# Altium schematic sheet Breeze2 Main V1.SchDoc
size 457 x 508 mm
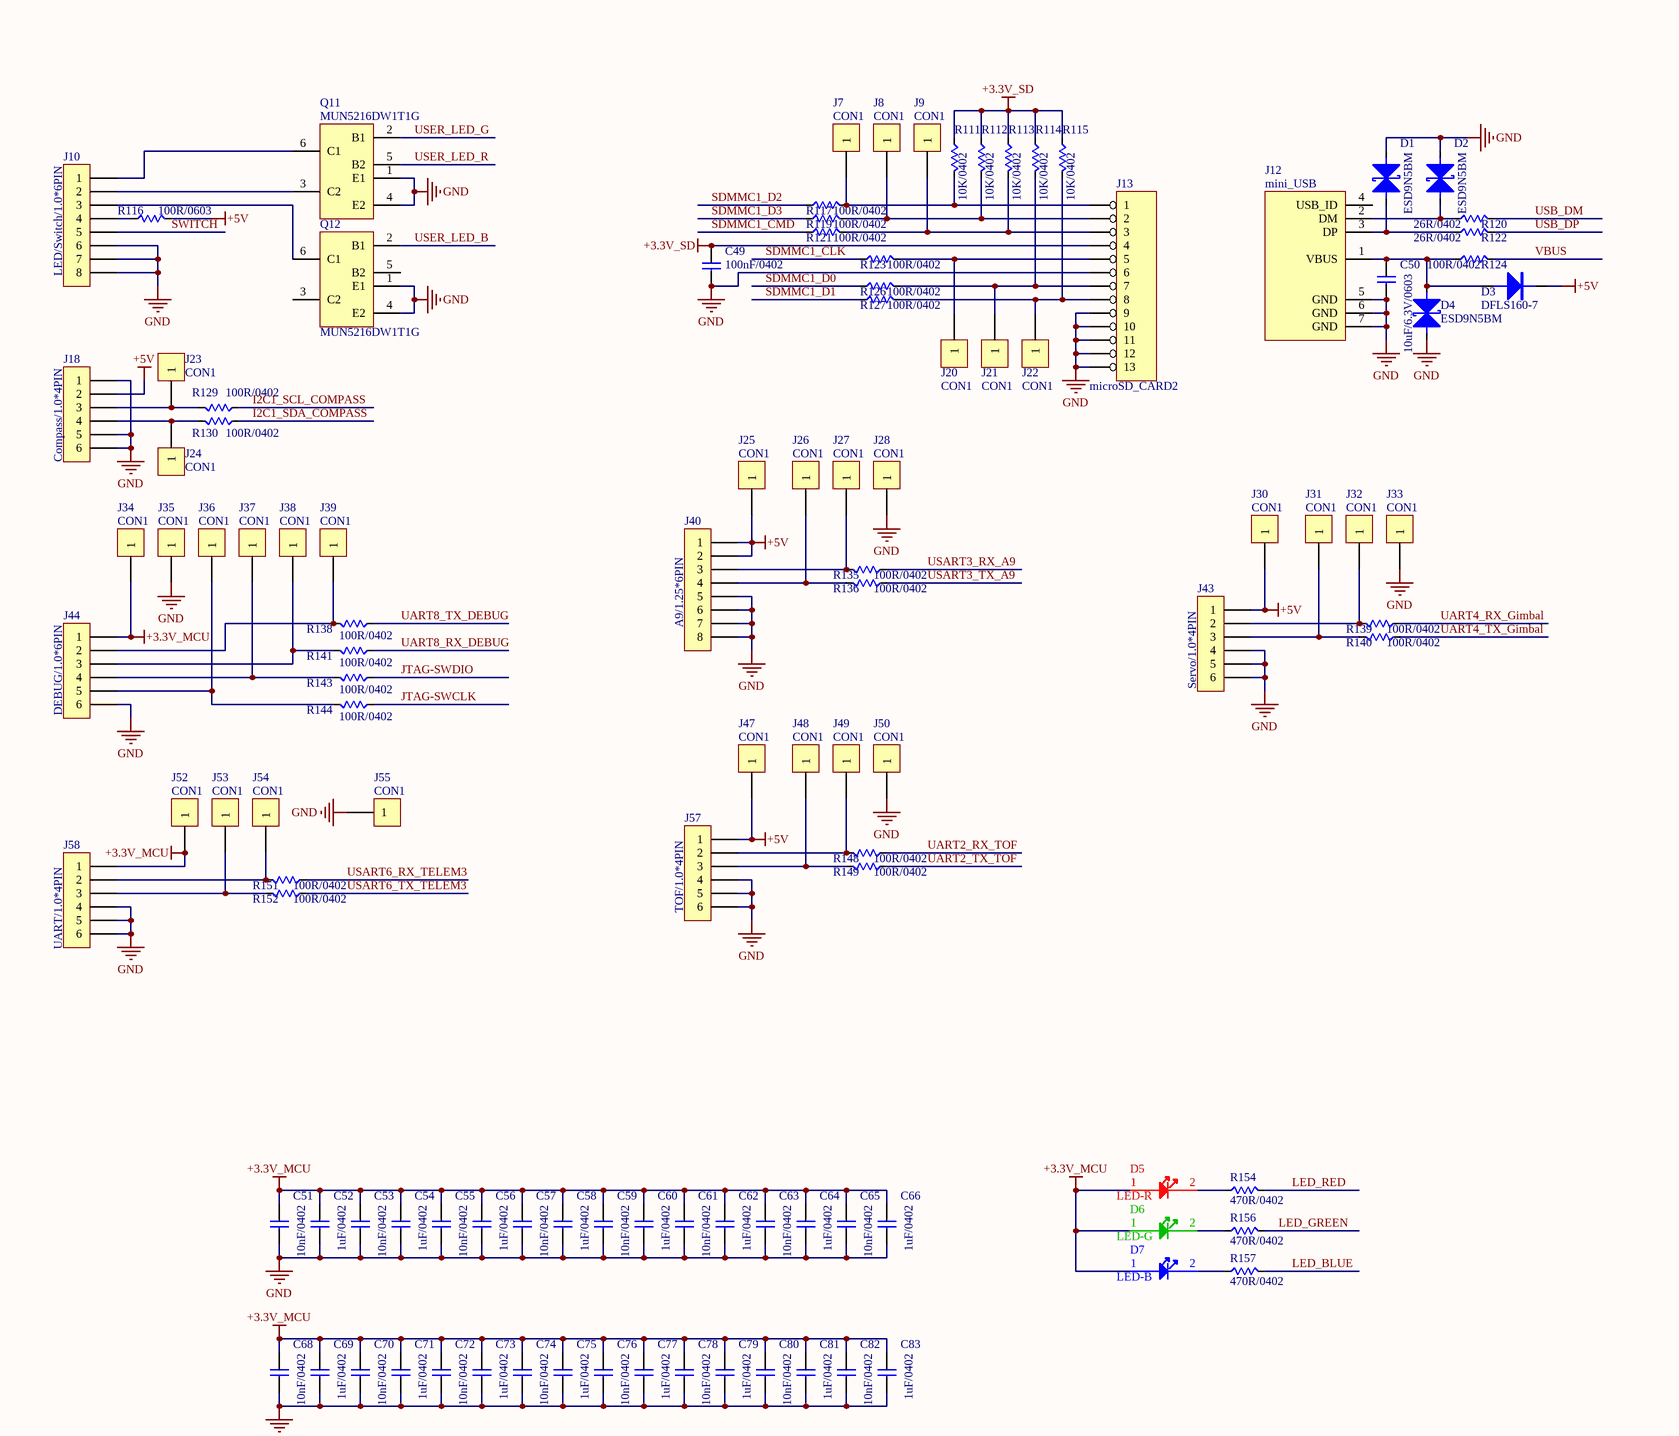
[diagram p0: Breeze2 Main V1.SchDoc, top left]
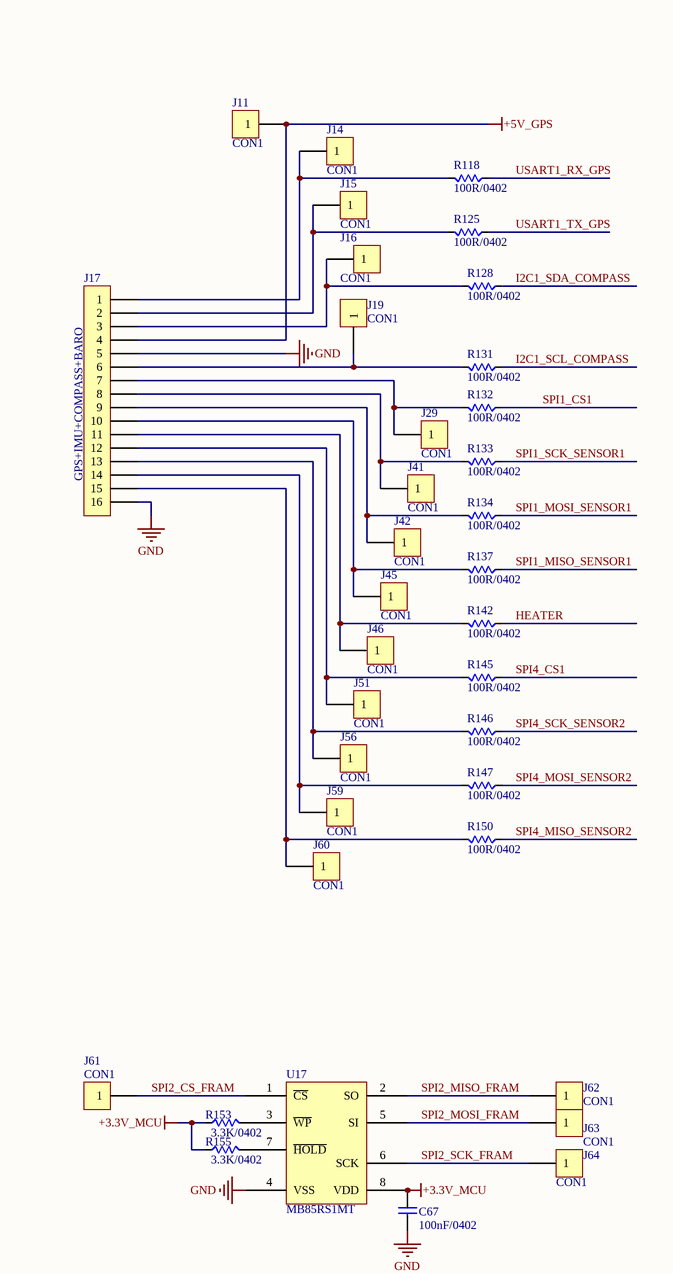
[diagram p1: Breeze2 Main V1.SchDoc, top right]
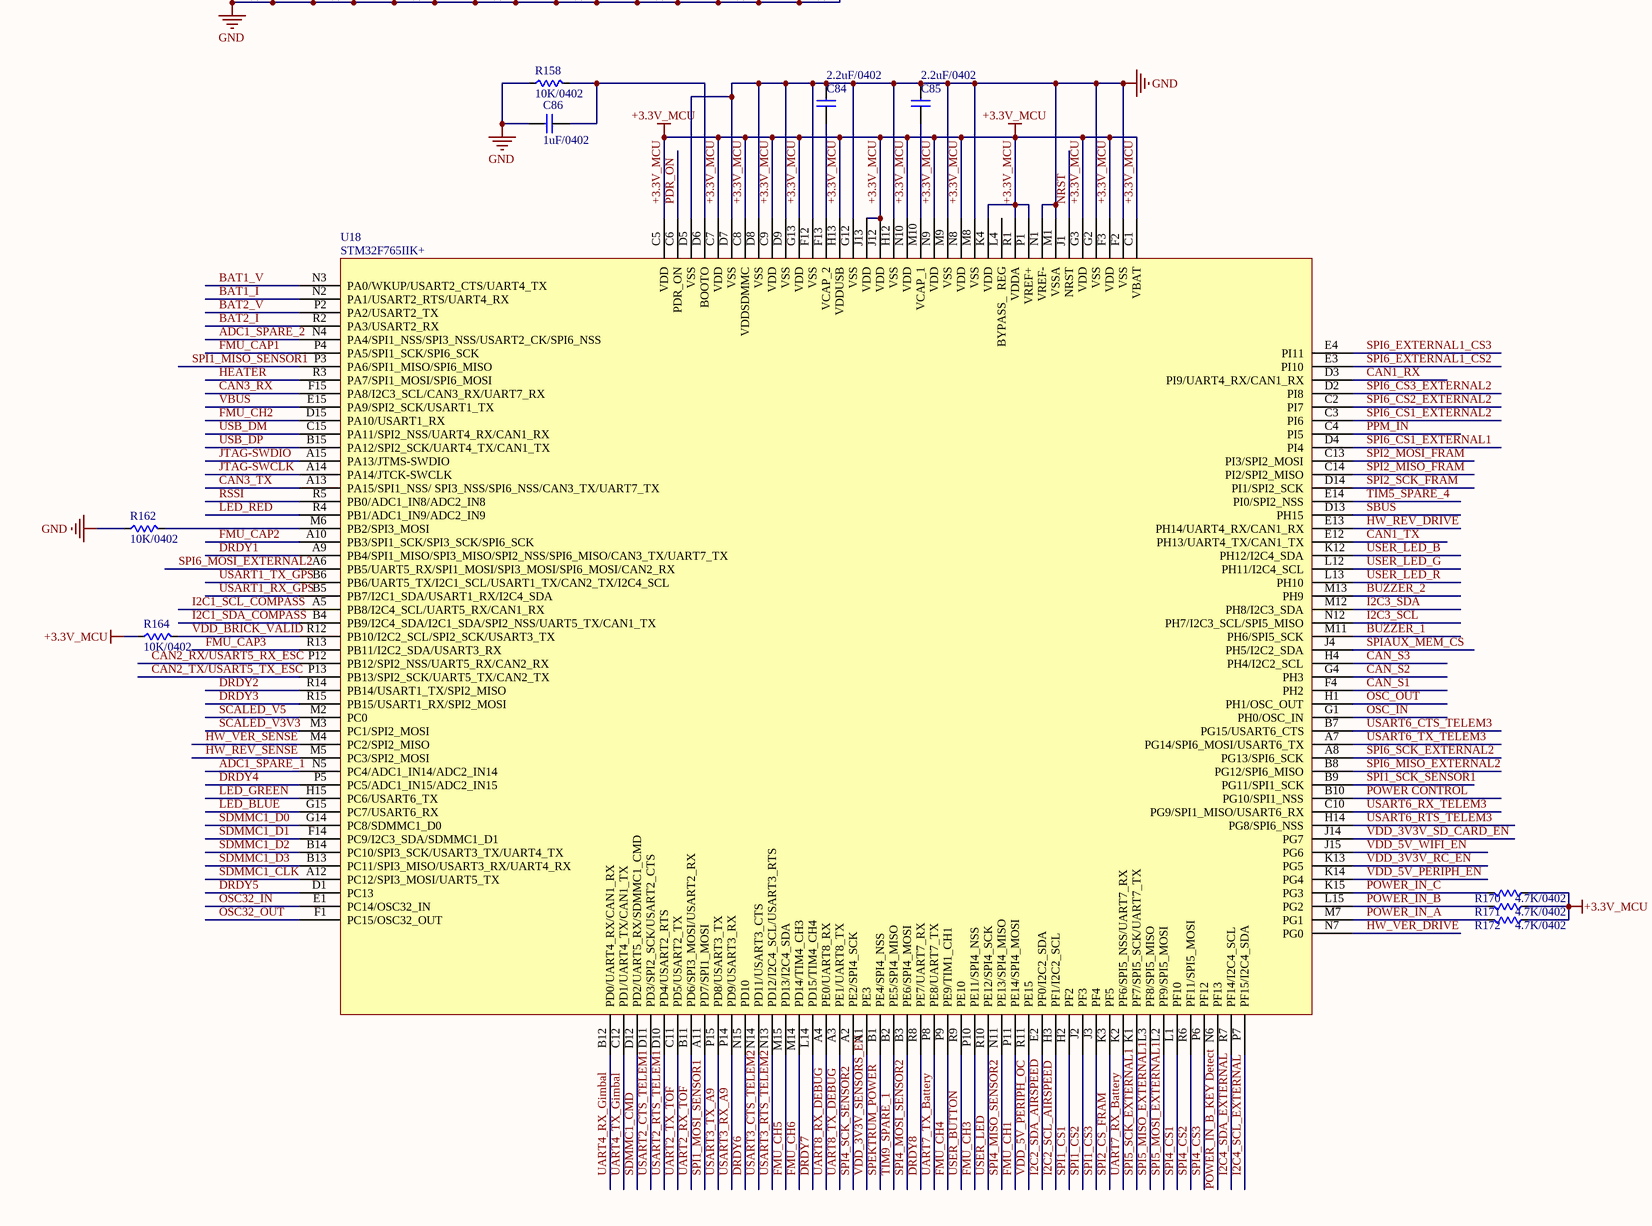
[diagram p2: Breeze2 Main V1.SchDoc, bottom left]
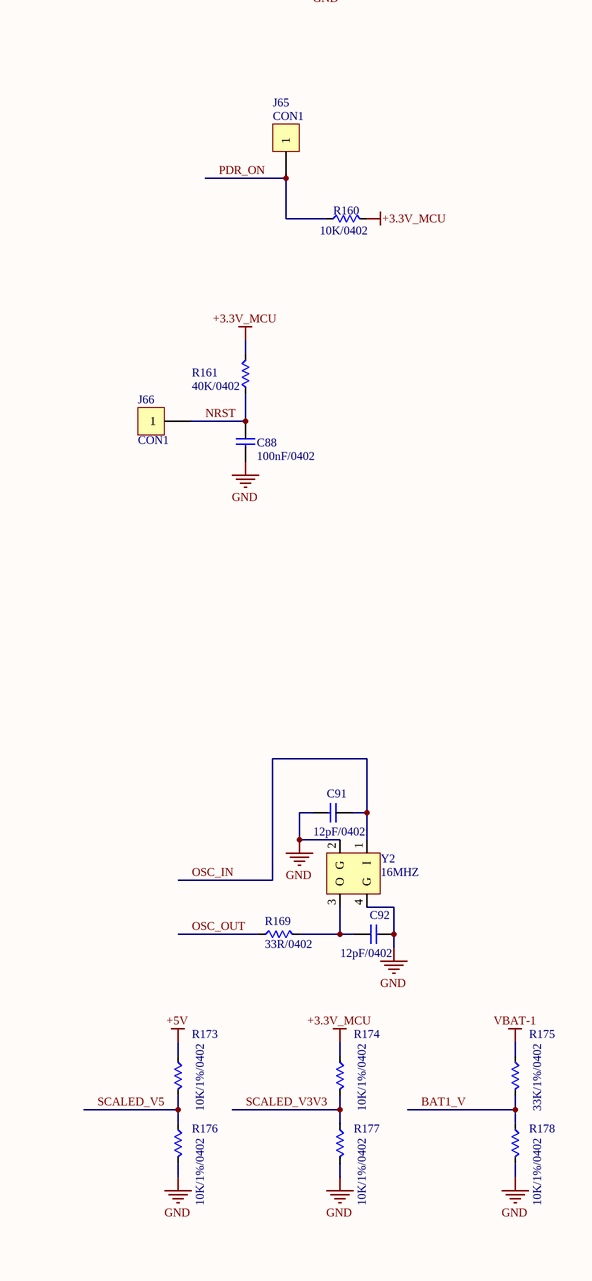
[diagram p3: Breeze2 Main V1.SchDoc, bottom right]

## Parts
C49  100nF/0402  [0402C-S]
C50  10uF/6.3V/0603  [0603C-S]
C51  10nF/0402  [0402C-S]
C52  1uF/0402  [0402C-S]
C53  10nF/0402  [0402C-S]
C54  1uF/0402  [0402C-S]
C55  10nF/0402  [0402C-S]
C56  1uF/0402  [0402C-S]
C57  10nF/0402  [0402C-S]
C58  1uF/0402  [0402C-S]
C59  10nF/0402  [0402C-S]
C60  1uF/0402  [0402C-S]
C61  10nF/0402  [0402C-S]
C62  1uF/0402  [0402C-S]
C63  10nF/0402  [0402C-S]
C64  1uF/0402  [0402C-S]
C65  10nF/0402  [0402C-S]
C66  1uF/0402  [0402C-S]
C67  100nF/0402  [0402C-S]
C68  10nF/0402  [0402C-S]
C69  1uF/0402  [0402C-S]
C70  10nF/0402  [0402C-S]
C71  1uF/0402  [0402C-S]
C72  10nF/0402  [0402C-S]
C73  1uF/0402  [0402C-S]
C74  10nF/0402  [0402C-S]
C75  1uF/0402  [0402C-S]
C76  10nF/0402  [0402C-S]
C77  1uF/0402  [0402C-S]
C78  10nF/0402  [0402C-S]
C79  1uF/0402  [0402C-S]
C80  10nF/0402  [0402C-S]
C81  1uF/0402  [0402C-S]
C82  10nF/0402  [0402C-S]
C83  1uF/0402  [0402C-S]
C84  2.2uF/0402  [0402C-S]
C85  2.2uF/0402  [0402C-S]
C86  1uF/0402  [0402C-S]
C88  100nF/0402  [0402C-S]
C91  12pF/0402  [0402C-S]
C92  12pF/0402  [0402C-S]
D1  ESD9N5BM  [0402R-S]
D2  ESD9N5BM  [0402R-S]
D3  DFLS160-7  [POWERDI-123]
D4  ESD9N5BM  [0402R-S]
D5  LED-R  [0603-LED-R]
D6  LED-G  [0603-LED-G]
D7  LED-B  [0603-LED-B]
J7  CON1  [TPJ1.0]
J8  CON1  [TPJ1.0]
J9  CON1  [TPJ1.0]
J10  LED/Switch/1.0*6PIN  [1.0*6PIN/SMD-H]
J11  CON1  [TPJ1.0]
J12  mini_USB  [USB-MINI-A]
J13  microSD_CARD2  [MICROSD_MINI]
J14  CON1  [TPJ1.0]
J15  CON1  [TPJ1.0]
J16  CON1  [TPJ1.0]
J17  GPS+IMU+COMPASS+BARO  [AYF531635]
J18  Compass/1.0*4PIN  [1.0*4PIN/SMD-H]
J19  CON1  [TPJ1.0]
J20  CON1  [TPJ1.0]
J21  CON1  [TPJ1.0]
J22  CON1  [TPJ1.0]
J23  CON1  [TPJ1.0]
J24  CON1  [TPJ1.0]
J25  CON1  [TPJ1.3]
J26  CON1  [TPJ1.0]
J27  CON1  [TPJ1.0]
J28  CON1  [TPJ1.3]
J29  CON1  [TPJ1.0]
J30  CON1  [TPJ1.3]
J31  CON1  [TPJ1.0]
J32  CON1  [TPJ1.0]
J33  CON1  [TPJ1.3]
J34  CON1  [TPJ1.0]
J35  CON1  [TPJ1.0]
J36  CON1  [TPJ1.0]
J37  CON1  [TPJ1.0]
J38  CON1  [TPJ1.0]
J39  CON1  [TPJ1.0]
J40  A9/1.25*6PIN  [1.25*6PIN/SMD]
J41  CON1  [TPJ1.0]
J42  CON1  [TPJ1.0]
J43  Servo/1.0*4PIN  [1.0*4PIN/SMD]
J44  DEBUG/1.0*6PIN  [1.0*6PIN/SMD]
J45  CON1  [TPJ1.0]
J46  CON1  [TPJ1.0]
J47  CON1  [TPJ1.2]
J48  CON1  [TPJ1.0]
J49  CON1  [TPJ1.0]
J50  CON1  [TPJ1.2]
J51  CON1  [TPJ1.0]
J52  CON1  [TPJ1.0]
J53  CON1  [TPJ1.0]
J54  CON1  [TPJ1.0]
J55  CON1  [TPJ1.0]
J56  CON1  [TPJ1.0]
J57  TOF/1.0*4PIN  [1.0*4PIN/SMD-H]
J58  UART/1.0*4PIN  [1.0*4PIN/SMD]
J59  CON1  [TPJ1.0]
J60  CON1  [TPJ1.0]
J61  CON1  [TPJ1.0]
J62  CON1  [TPJ1.0]
J63  CON1  [TPJ1.0]
J64  CON1  [TPJ1.0]
J65  CON1  [TPJ1.0]
J66  CON1  [TPJ1.0]
Q11  MUN5216DW1T1G  [SOT-363A]
Q12  MUN5216DW1T1G  [SOT-363A]
R111  10K/0402  [0402R-S]
R112  10K/0402  [0402R-S]
R113  10K/0402  [0402R-S]
R114  10K/0402  [0402R-S]
R115  10K/0402  [0402R-S]
R116  100R/0603  [0603R-S]
R117  100R/0402  [0402R-S]
R118  100R/0402  [0402R-S]
R119  100R/0402  [0402R-S]
R120  26R/0402  [0402R-S]
R121  100R/0402  [0402R-S]
R122  26R/0402  [0402R-S]
R123  100R/0402  [0402R-S]
R124  100R/0402  [0402R-S]
R125  100R/0402  [0402R-S]
R126  100R/0402  [0402R-S]
R127  100R/0402  [0402R-S]
R128  100R/0402  [0402R-S]
R129  100R/0402  [0402R-S]
R130  100R/0402  [0402R-S]
R131  100R/0402  [0402R-S]
R132  100R/0402  [0402R-S]
R133  100R/0402  [0402R-S]
R134  100R/0402  [0402R-S]
R135  100R/0402  [0402R-S]
R136  100R/0402  [0402R-S]
R137  100R/0402  [0402R-S]
R138  100R/0402  [0402R-S]
R139  100R/0402  [0402R-S]
R140  100R/0402  [0402R-S]
R141  100R/0402  [0402R-S]
R142  100R/0402  [0402R-S]
R143  100R/0402  [0402R-S]
R144  100R/0402  [0402R-S]
R145  100R/0402  [0402R-S]
R146  100R/0402  [0402R-S]
R147  100R/0402  [0402R-S]
R148  100R/0402  [0402R-S]
R149  100R/0402  [0402R-S]
R150  100R/0402  [0402R-S]
R151  100R/0402  [0402R-S]
R152  100R/0402  [0402R-S]
R153  3.3K/0402  [0402R-S]
R154  470R/0402  [0402R-S]
R155  3.3K/0402  [0402R-S]
R156  470R/0402  [0402R-S]
R157  470R/0402  [0402R-S]
R158  10K/0402  [0402R-S]
R160  10K/0402  [0402R-S]
R161  40K/0402  [0402R-S]
R162  10K/0402  [0402R-S]
R164  10K/0402  [0402R-S]
R169  33R/0402  [0402R-S]
R170  4.7K/0402  [0402R-S]
R171  4.7K/0402  [0402R-S]
R172  4.7K/0402  [0402R-S]
R173  10K/1%/0402  [0402R-S]
R174  10K/1%/0402  [0402R-S]
R175  33K/1%/0402  [0402R-S]
R176  10K/1%/0402  [0402R-S]
R177  10K/1%/0402  [0402R-S]
R178  10K/1%/0402  [0402R-S]
U17  MB85RS1MT  [SO-8A]
U18  STM32F765IIK+  [UFBGA176/10*10]
Y2  16MHZ  [Y3225]

## Nets
+3.3V_MCU: C51.1 C52.1 C53.1 C54.1 C55.1 C56.1 C57.1 C58.1 C59.1 C60.1 C61.1 C62.1 C63.1 C64.1 C65.1 C66.1 C67.1 C68.1 C69.1 C70.1 C71.1 C72.1 C73.1 C74.1 C75.1 C76.1 C77.1 C78.1 C79.1 C80.1 C81.1 C82.1 C83.1 D5.1(A) D6.1(A) D7.1(A) J34.1 J44.1 J52.1 J58.1 R153.1 R155.1 R160.2 R161.2 R164.1 R170.1 R171.1 R172.1 R174.1 U17.8(VDD) U18.C1(VBAT) U18.C5(VDD) U18.C7(VDD) U18.C8(VDDSDMMC) U18.C9(VDD) U18.F3(VDD) U18.G3(VDD) U18.G13(VDD) U18.H13(VDDUSB) U18.J12(VDD) U18.J13(VDD) U18.K4(VDD) U18.N8(VDD) U18.N9(VDD) U18.N10(VDD) U18.P1(VREF+) U18.R1(VDDA)
+3.3V_SD: C49.1 J13.4 R111.1 R112.1 R113.1 R114.1 R115.1
+5V: D3.2(K) J18.2 J25.1 J30.1 J40.1 J40.2 J43.1 J47.1 J57.1 R116.2 R173.1
+5V_GPS: J11.1 J17.4
GND: C49.2 C50.2 C51.2 C52.2 C53.2 C54.2 C55.2 C56.2 C57.2 C58.2 C59.2 C60.2 C61.2 C62.2 C63.2 C64.2 C65.2 C66.2 C67.2 C68.2 C69.2 C70.2 C71.2 C72.2 C73.2 C74.2 C75.2 C76.2 C77.2 C78.2 C79.2 C80.2 C81.2 C82.2 C83.2 C84.2 C85.2 C86.2 C88.2 C91.2 C92.2 D1.1 D2.1 D4.1 J10.6 J10.7 J10.8 J12.5(GND) J12.6(GND) J12.7(GND) J13.6 J13.9 J13.10 J13.11 J13.12 J13.13 J17.5 J17.16 J18.1 J18.5 J18.6 J28.1 J33.1 J35.1 J40.5 J40.6 J40.7 J40.8 J43.4 J43.5 J43.6 J44.6 J50.1 J55.1 J57.4 J57.5 J57.6 J58.4 J58.5 J58.6 Q11.1(E1) Q11.4(E2) Q12.1(E1) Q12.4(E2) R158.1 R162.1 R176.2 R177.2 R178.2 U17.4(VSS) U18.D5(VSS) U18.D7(VSS) U18.D8(VSS) U18.D9(VSS) U18.F2(VSS) U18.F12(VSS) U18.G2(VSS) U18.G12(VSS) U18.H12(VSS) U18.M1(VSSA) U18.M8(VSS) U18.M9(VSS) U18.N1(VREF-) Y2.2(G) Y2.4(G)
VBAT-1: R175.1
ADC1_SPARE_1: U18.N5(PC4/ADC1_IN14/ADC2_IN14)
ADC1_SPARE_2: U18.N4(PA4/SPI1_NSS/SPI3_NSS/USART2_CK/SPI6_NSS)
BAT1_I: U18.N2(PA1/USART2_RTS/UART4_RX)
BAT1_V: R175.2 R178.1 U18.N3(PA0/WKUP/USART2_CTS/UART4_TX)
BAT2_I: U18.R2(PA3/USART2_RX)
BAT2_V: U18.P2(PA2/USART2_TX)
BUZZER_1: U18.M11(PH6/SPI5_SCK)
BUZZER_2: U18.M13(PH9)
CAN1_RX: U18.D3(PI9/UART4_RX/CAN1_RX)
CAN1_TX: U18.E12(PH13/UART4_TX/CAN1_TX)
CAN2_RX/USART5_RX_ESC: U18.P12(PB12/SPI2_NSS/UART5_RX/CAN2_RX)
CAN2_TX/USART5_TX_ESC: U18.P13(PB13/SPI2_SCK/UART5_TX/CAN2_TX)
CAN3_RX: U18.F15(PA8/I2C3_SCL/CAN3_RX/UART7_RX)
CAN3_TX: U18.A13(PA15/SPI1_NSS/_SPI3_NSS/SPI6_NSS/CAN3_TX/UART7_TX)
CAN_S1: U18.F4(PH2)
CAN_S2: U18.G4(PH3)
CAN_S3: U18.H4(PH4/I2C2_SCL)
DRDY1: U18.A9(PB4/SPI1_MISO/SPI3_MISO/SPI2_NSS/SPI6_MISO/CAN3_TX/UART7_TX)
DRDY2: U18.R14(PB14/USART1_TX/SPI2_MISO)
DRDY3: U18.R15(PB15/USART1_RX/SPI2_MOSI)
DRDY4: U18.P5(PC5/ADC1_IN15/ADC2_IN15)
DRDY5: U18.D1(PC13)
DRDY6: U18.N15(PD10)
DRDY7: U18.L14(PD15/TIM4_CH4)
DRDY8: U18.R8(PE7/UART7_RX)
FMU_CAP1: U18.P4(PA5/SPI1_SCK/SPI6_SCK)
FMU_CAP2: U18.A10(PB3/SPI1_SCK/SPI3_SCK/SPI6_SCK)
FMU_CAP3: U18.R13(PB11/I2C2_SDA/USART3_RX)
FMU_CH1: U18.P11(PE14/SPI4_MOSI)
FMU_CH2: U18.D15(PA10/USART1_RX)
FMU_CH3: U18.P10(PE11/SPI4_NSS)
FMU_CH4: U18.P9(PE9/TIM1_CH1)
FMU_CH5: U18.M15(PD13/I2C4_SDA)
FMU_CH6: U18.M14(PD14/TIM4_CH3)
HEATER: R142.1 U18.R3(PA7/SPI1_MOSI/SPI6_MOSI)
HW_REV_DRIVE: U18.E13(PH14/UART4_RX/CAN1_RX)
HW_REV_SENSE: U18.M5(PC3/SPI2_MOSI)
HW_VER_DRIVE: U18.N7(PG0)
HW_VER_SENSE: U18.M4(PC2/SPI2_MISO)
I2C1_SCL_COMPASS: R129.1 R131.1 U18.A5(PB8/I2C4_SCL/UART5_RX/CAN1_RX)
I2C1_SDA_COMPASS: R128.1 R130.1 U18.B4(PB9/I2C4_SDA/I2C1_SDA/SPI2_NSS/UART5_TX/CAN1_TX)
I2C2_SCL_AIRSPEED: U18.H3(PF1/I2C2_SCL)
I2C2_SDA_AIRSPEED: U18.E2(PF0/I2C2_SDA)
I2C3_SCL: U18.N12(PH7/I2C3_SCL/SPI5_MISO)
I2C3_SDA: U18.M12(PH8/I2C3_SDA)
I2C4_SCL_EXTERNAL: U18.P7(PF15/I2C4_SDA)
I2C4_SDA_EXTERNAL: U18.R7(PF14/I2C4_SCL)
JTAG-SWCLK: R144.1 U18.A14(PA14/JTCK-SWCLK)
JTAG-SWDIO: R143.1 U18.A15(PA13/JTMS-SWDIO)
LED_BLUE: R157.2 U18.G15(PC7/USART6_RX)
LED_GREEN: R156.2 U18.H15(PC6/USART6_TX)
LED_RED: R154.2 U18.R4(PB1/ADC1_IN9/ADC2_IN9)
NRST: C88.1 J66.1 R161.1 U18.J1(NRST)
OSC32_IN: U18.E1(PC14/OSC32_IN)
OSC32_OUT: U18.F1(PC15/OSC32_OUT)
OSC_IN: C91.1 U18.G1(PH0/OSC_IN) Y2.1(I)
OSC_OUT: R169.1 U18.H1(PH1/OSC_OUT)
PDR_ON: J65.1 R160.1 U18.C6(PDR_ON)
POWER CONTROL: U18.B10(PG10/SPI1_NSS)
POWER_IN_A: R172.2 U18.M7(PG1)
POWER_IN_B: R171.2 U18.L15(PG2)
POWER_IN_B_KEY Detect: U18.N6(PF13)
POWER_IN_C: R170.2 U18.K15(PG3)
PPM_IN: U18.C4(PI5)
RSSI: U18.R5(PB0/ADC1_IN8/ADC2_IN8)
SBUS: U18.D13(PH15)
SCALED_V3V3: R174.2 R177.1 U18.M3(PC1/SPI2_MOSI)
SCALED_V5: R173.2 R176.1 U18.M2(PC0)
SDMMC1_CLK: R123.1 U18.A12(PC12/SPI3_MOSI/UART5_TX)
SDMMC1_CMD: R121.1 U18.D12(PD2/UART5_RX/SDMMC1_CMD)
SDMMC1_D0: R126.1 U18.G14(PC8/SDMMC1_D0)
SDMMC1_D1: R127.1 U18.F14(PC9/I2C3_SDA/SDMMC1_D1)
SDMMC1_D2: R117.1 U18.B14(PC10/SPI3_SCK/USART3_TX/UART4_TX)
SDMMC1_D3: R119.1 U18.B13(PC11/SPI3_MISO/USART3_RX/UART4_RX)
SPEKTRUM_POWER: U18.B1(PE4/SPI4_NSS)
SPI1_CS1: R132.1 U18.H2(PF2)
SPI1_CS2: U18.J2(PF3)
SPI1_CS3: U18.J3(PF4)
SPI1_MISO_SENSOR1: R137.1 U18.P3(PA6/SPI1_MISO/SPI6_MISO)
SPI1_MOSI_SENSOR1: R134.1 U18.A11(PD7/SPI1_MOSI)
SPI1_SCK_SENSOR1: R133.1 U18.B9(PG11/SPI1_SCK)
SPI2_CS_FRAM: J61.1 U17.1(~{CS}) U18.K3(PF5)
SPI2_MISO_FRAM: J62.1 U17.2(SO) U18.C14(PI2/SPI2_MISO)
SPI2_MOSI_FRAM: J63.1 U17.5(SI) U18.C13(PI3/SPI2_MOSI)
SPI2_SCK_FRAM: J64.1 U17.6(SCK) U18.D14(PI1/SPI2_SCK)
SPI4_CS1: R145.1 U18.L1(PF10)
SPI4_CS2: U18.R6(PF11/SPI5_MOSI)
SPI4_CS3: U18.P6(PF12)
SPI4_MISO_SENSOR2: R150.1 U18.N11(PE13/SPI4_MISO)
SPI4_MOSI_SENSOR2: R147.1 U18.B3(PE6/SPI4_MOSI)
SPI4_SCK_SENSOR2: R146.1 U18.A2(PE2/SPI4_SCK)
SPI5_MISO_EXTERNAL1: U18.L3(PF8/SPI5_MISO)
SPI5_MOSI_EXTERNAL1: U18.L2(PF9/SPI5_MOSI)
SPI5_SCK_EXTERNAL1: U18.K1(PF7/SPI5_SCK/UART7_TX)
SPI6_CS1_EXTERNAL1: U18.D4(PI4)
SPI6_CS1_EXTERNAL2: U18.C3(PI6)
SPI6_CS2_EXTERNAL2: U18.C2(PI7)
SPI6_CS3_EXTERNAL2: U18.D2(PI8)
SPI6_EXTERNAL1_CS2: U18.E3(PI10)
SPI6_EXTERNAL1_CS3: U18.E4(PI11)
SPI6_MISO_EXTERNAL2: U18.B8(PG12/SPI6_MISO)
SPI6_MOSI_EXTERNAL2: U18.A6(PB5/UART5_RX/SPI1_MOSI/SPI3_MOSI/SPI6_MOSI/CAN2_RX)
SPI6_SCK_EXTERNAL2: U18.A8(PG13/SPI6_SCK)
SPIAUX_MEM_CS: U18.J4(PH5/I2C2_SDA)
SWITCH: J10.5
TIM5_SPARE_4: U18.E14(PI0/SPI2_NSS)
TIM9_SPARE_1: U18.B2(PE5/SPI4_MISO)
UART2_RX_TOF: R148.1 U18.B11(PD6/SPI3_MOSI/USART2_RX)
UART2_TX_TOF: R149.1 U18.C11(PD5/USART2_TX)
UART4_RX_Gimbal: R139.1 U18.B12(PD0/UART4_RX/CAN1_RX)
UART4_TX_Gimbal: R140.1 U18.C12(PD1/UART4_TX/CAN1_TX)
UART7_RX_Battery: U18.K2(PF6/SPI5_NSS/UART7_RX)
UART7_TX_Battery: U18.P8(PE8/UART7_TX)
UART8_RX_DEBUG: R141.1 U18.A4(PE0/UART8_RX)
UART8_TX_DEBUG: R138.1 U18.A3(PE1/UART8_TX)
USART1_RX_GPS: R118.1 U18.B5(PB7/I2C1_SDA/USART1_RX/I2C4_SDA)
USART1_TX_GPS: R125.1 U18.B6(PB6/UART5_TX/I2C1_SCL/USART1_TX/CAN2_TX/I2C4_SCL)
USART2_CTS_TELEM1: U18.D11(PD3/SPI2_SCK/USART2_CTS)
USART2_RTS_TELEM1: U18.D10(PD4/USART2_RTS)
USART3_CTS_TELEM2: U18.N14(PD11/USART3_CTS)
USART3_RTS_TELEM2: U18.N13(PD12/I2C4_SCL/USART3_RTS)
USART3_RX_A9: R135.1 U18.P14(PD9/USART3_RX)
USART3_TX_A9: R136.1 U18.P15(PD8/USART3_TX)
USART6_CTS_TELEM3: U18.B7(PG15/USART6_CTS)
USART6_RTS_TELEM3: U18.H14(PG8/SPI6_NSS)
USART6_RX_TELEM3: R151.1 U18.C10(PG9/SPI1_MISO/USART6_RX)
USART6_TX_TELEM3: R152.1 U18.A7(PG14/SPI6_MOSI/USART6_TX)
USB_DM: R120.1 U18.C15(PA11/SPI2_NSS/UART4_RX/CAN1_RX)
USB_DP: R122.1 U18.B15(PA12/SPI2_SCK/UART4_TX/CAN1_TX)
USER_BUTTON: U18.R9(PE10)
USER_LED: U18.R10(PE12/SPI4_SCK)
USER_LED_B: Q12.2(B1) U18.K12(PH12/I2C4_SDA)
USER_LED_G: Q11.2(B1) U18.L12(PH11/I2C4_SCL)
USER_LED_R: Q11.5(B2) U18.L13(PH10)
VBUS: R124.1 U18.E15(PA9/SPI2_SCK/USART1_TX)
VDD_3V3V_RC_EN: U18.K13(PG5)
VDD_3V3V_SD_CARD_EN: U18.J14(PG7)
VDD_3V3V_SENSORS_EN: U18.A1(PE3)
VDD_5V_PERIPH_EN: U18.K14(PG4)
VDD_5V_PERIPH_OC: U18.R11(PE15)
VDD_5V_WIFI_EN: U18.J15(PG6)
VDD_BRICK_VALID: R164.2 U18.R12(PB10/I2C2_SCL/SPI2_SCK/USART3_TX)
NetC50_1: C50.1 D3.1(A) D4.2 J12.1(VBUS) R124.2
NetC84_1: C84.1 U18.F13(VCAP_2)
NetC85_1: C85.1 U18.M10(VCAP_1)
NetC86_1: C86.1 R158.2 U18.D6(BOOTO)
NetC92_1: C92.1 R169.2 Y2.3(O)
NetD1_2: D1.2 J12.3(DP) R122.2
NetD2_2: D2.2 J12.2(DM) R120.2
NetD5_2: D5.2(K) R154.1
NetD6_2: D6.2(K) R156.1
NetD7_2: D7.2(K) R157.1
NetJ7_1: J7.1 J13.1 R111.2 R117.2
NetJ8_1: J8.1 J13.2 R112.2 R119.2
NetJ9_1: J9.1 J13.3 R113.2 R121.2
NetJ10_1: J10.1 Q11.6(C1)
NetJ10_2: J10.2 Q11.3(C2)
NetJ10_3: J10.3 Q12.6(C1)
NetJ10_4: J10.4 R116.1
NetJ13_5: J13.5 J20.1 R123.2
NetJ13_7: J13.7 J21.1 R114.2 R126.2
NetJ13_8: J13.8 J22.1 R115.2 R127.2
NetJ14_1: J14.1 J17.1 R118.2
NetJ15_1: J15.1 J17.2 R125.2
NetJ16_1: J16.1 J17.3 R128.2
NetJ17_6: J17.6 J19.1 R131.2
NetJ17_7: J17.7 J29.1 R132.2
NetJ17_8: J17.8 J41.1 R133.2
NetJ17_9: J17.9 J42.1 R134.2
NetJ17_10: J17.10 J45.1 R137.2
NetJ17_11: J17.11 J46.1 R142.2
NetJ17_12: J17.12 J51.1 R145.2
NetJ17_13: J17.13 J56.1 R146.2
NetJ17_14: J17.14 J59.1 R147.2
NetJ17_15: J17.15 J60.1 R150.2
NetJ18_3: J18.3 J23.1 R129.2
NetJ18_4: J18.4 J24.1 R130.2
NetJ26_1: J26.1 J40.4 R136.2
NetJ27_1: J27.1 J40.3 R135.2
NetJ31_1: J31.1 J43.3 R140.2
NetJ32_1: J32.1 J43.2 R139.2
NetJ36_1: J36.1 J44.5 R144.2
NetJ37_1: J37.1 J44.4 R143.2
NetJ38_1: J38.1 J44.3 R141.2
NetJ39_1: J39.1 J44.2 R138.2
NetJ48_1: J48.1 J57.3 R149.2
NetJ49_1: J49.1 J57.2 R148.2
NetJ53_1: J53.1 J58.3 R152.2
NetJ54_1: J54.1 J58.2 R151.2
NetR153_2: R153.2 U17.3(~{WP})
NetR155_2: R155.2 U17.7(~{HOLD})
NetR162_2: R162.2 U18.M6(PB2/SPI3_MOSI)

Not connected (* = marked no-connect by the designer): J12 4(USB_ID); Q12 3(C2) 5(B2); U18 L4(BYPASS___REG)

## Library data of the parts
C49-C86 C88 C91 C92 = CAP
D1 D2 D4 = DIODE SCHOTTKY: ESD
D3 = DIODE
J7-J9 J11 J14-J16 J19-J39 J41 J42 J45-J56 J59-J66 = CON1: Connector
J10 J40 = CON8: Connector
J13 = HEADER 13
J17 = CON16: Connector
J18 J43 J44 J57 J58 = CON6: Connector
Q11 Q12 = MUN5216DW1T1
R111-R115 R117-R158 R160-R162 R164 R169-R178 = Res
R116 = RES
Y2 = Crystal2